# Altium schematic sheet SYSMON.SchDoc
size A3
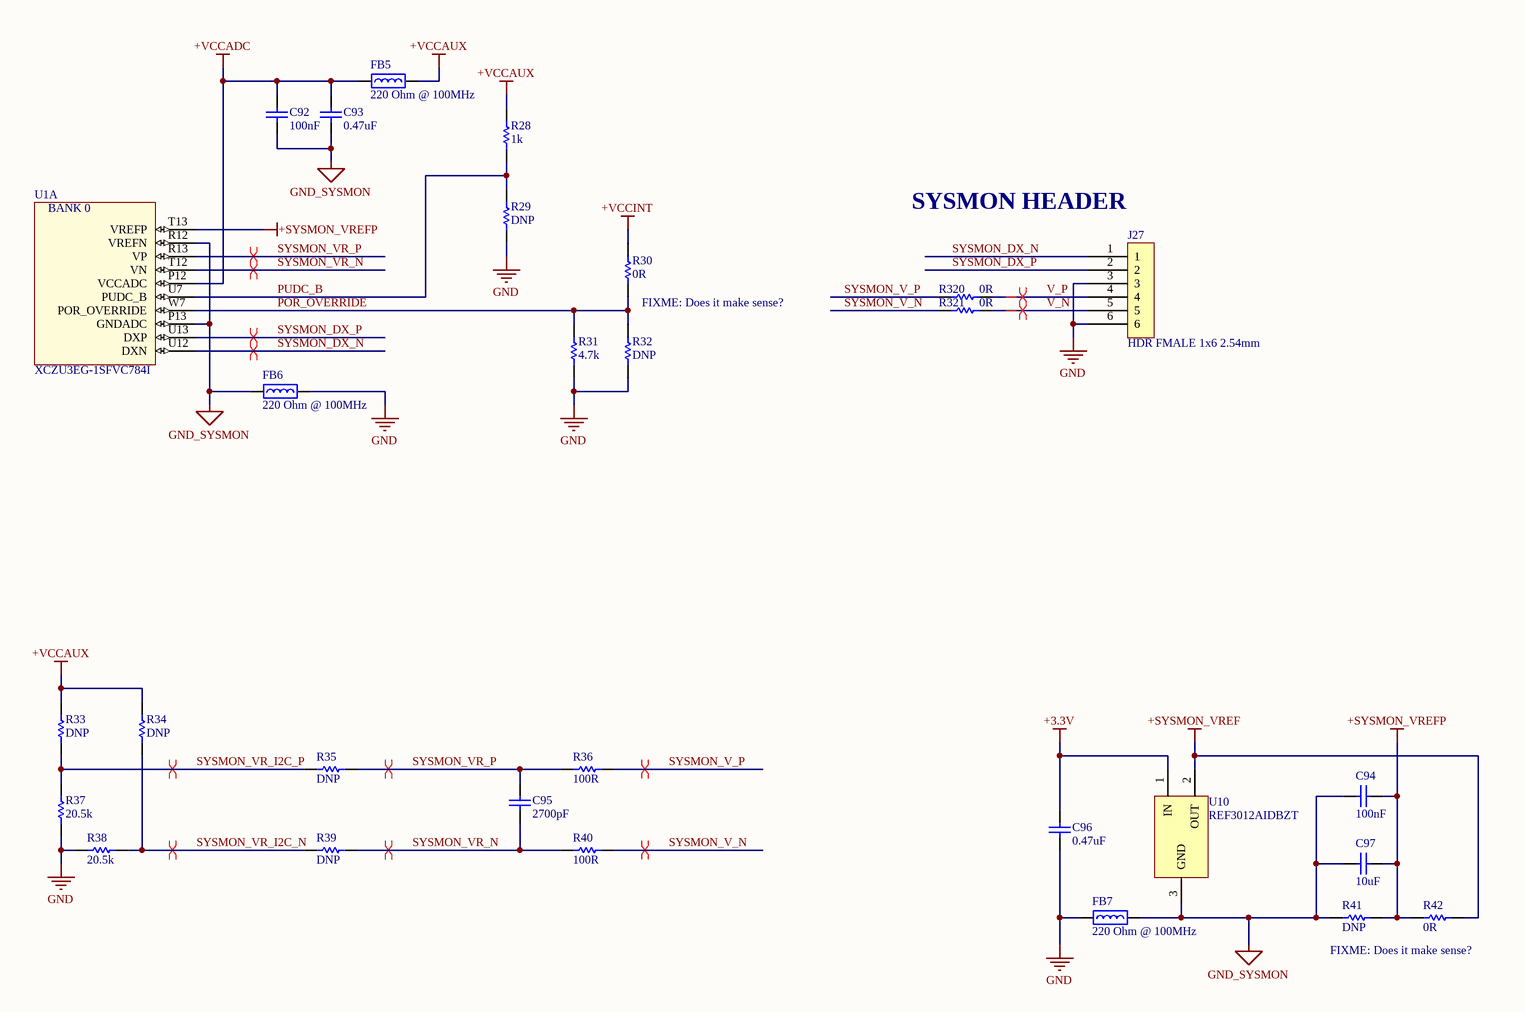
[diagram p0: SYSMON.SchDoc]

## Parts
C92  100nF  [CAPC1005L_0402]
C93  0.47uF  [CAPC1005L_0402]
C94  100nF  [CAPC1005L_0402]
C95  2700pF  [CAPC1005L_0402]
C96  0.47uF  [CAPC1005L_0402]
C97  10uF  [CAPC1005L_0402]
FB5  Impedance @ Frequency: 220 Ohm @ 100MHz  [INDC1608N_0603]  (hidden comment: BEAD0603_220_2A5_40M)
FB6  Impedance @ Frequency: 220 Ohm @ 100MHz  [INDC1608N_0603]  (hidden comment: BEAD0603_220_2A5_40M)
FB7  Impedance @ Frequency: 220 Ohm @ 100MHz  [INDC1608N_0603]  (hidden comment: BEAD0603_220_2A5_40M)
J27  HDR FMALE 1x6 2.54mm  [Hdr_Female_1x6_2.54mm]
R28  value 1k  [RESC1005L_0402]  (hidden comment: RES0402_1K_0W1_1T)
R29  value DNP  [RESC1005L_0402]  (hidden comment: RES0402)
R30  value 0R  [RESC1005L_0402]  (hidden comment: RES0402_0R_0W1)
R31  value 4.7k  [RESC1005L_0402]  (hidden comment: RES0402_4K7_0W1_1T)
R32  value DNP  [RESC1005L_0402]  (hidden comment: RES0402)
R33  value DNP  [RESC1005L_0402]  (hidden comment: RES0402)
R34  value DNP  [RESC1005L_0402]  (hidden comment: RES0402)
R35  value DNP  [RESC1005L_0402]  (hidden comment: RES0402)
R36  value 100R  [RESC1005L_0402]  (hidden comment: RES0402_100R_0W1_1T)
R37  value 20.5k  [RESC1005L_0402]  (hidden comment: RES0402_20K5_0W1_1T)
R38  value 20.5k  [RESC1005L_0402]  (hidden comment: RES0402_20K5_0W1_1T)
R39  value DNP  [RESC1005L_0402]  (hidden comment: RES0402)
R40  value 100R  [RESC1005L_0402]  (hidden comment: RES0402_100R_0W1_1T)
R41  value DNP  [RESC1005L_0402]  (hidden comment: RES0402)
R42  value 0R  [RESC1005L_0402]  (hidden comment: RES0402_0R_0W1)
R320  value 0R  [RESC1005L_0402]  (hidden comment: RES0402_0R_0W1)
R321  value 0R  [RESC1005L_0402]  (hidden comment: RES0402_0R_0W1)
U1  XCZU3EG-1SFVC784I  [BGA784x28]  (part A of 22)
U10  REF3012AIDBZT  [TI-DBZ3_N]

## Nets
+3.3V: C96.1 U10.1(IN)
+SYSMON_VREF: R42.1 U10.2(OUT)
+SYSMON_VREFP: C94.1 C97.2 R41.1 R42.2 U1.T13(VREFP)
+VCCADC: C92.1 C93.1 FB5.1 U1.P12(VCCADC)
+VCCAUX: FB5.2 R28.1 R33.1 R34.1
+VCCINT: R30.1
GND: C96.2 FB6.2 FB7.1 J27.3 J27.6 R29.2 R31.2 R32.2 R37.2 R38.2
GND_SYSMON: C92.2 C93.2 C94.2 C97.1 FB6.1 FB7.2 R41.2 U1.P13(GNDADC) U1.R12(VREFN) U10.3(GND)
POR_OVERRIDE: R30.2 R31.1 R32.1 U1.W7(POR_OVERRIDE)
PUDC_B: R28.2 R29.1 U1.U7(PUDC_B)
SYSMON_DX_N: J27.1 U1.U12(DXN)
SYSMON_DX_P: J27.2 U1.U13(DXP)
SYSMON_V_N: R40.2 R321.1
SYSMON_V_P: R36.2 R320.1
SYSMON_VR_I2C_N: R34.2 R38.1 R39.2
SYSMON_VR_I2C_P: R33.2 R35.2 R37.1
SYSMON_VR_N: C95.2 R39.1 R40.1 U1.T12(VN)
SYSMON_VR_P: C95.1 R35.1 R36.1 U1.R13(VP)
V_N: J27.5 R321.2
V_P: J27.4 R320.2

## Layout directives
differential pair: SYSMON_DX_N, SYSMON_DX_P, SYSMON_V_N, SYSMON_V_P, SYSMON_VR_I2C_N, SYSMON_VR_I2C_P, SYSMON_VR_N, SYSMON_VR_P, V_N, V_P

## Notes on the sheet
- SYSMON HEADER
- FIXME: Does it make sense?
- (in symbol XCZU3EG-1SFVC784I, part A) BANK 0

## Library data of the parts
C92 C94 = CAPCER0402X7R100N25V_10T: CAP CER 0.1UF 25V X7R 0402; Manufacturer 1: Murata Electronics North America; Manufacturer Part Number 1: GRM155R71E104KE14D; Tolerance: 10%; Package: 0402; ComponentLink1Description: Datasheet; Value: 100nF; Voltage: 25V; Temperature Coefficient: X7R; Supplier 1: Digi-Key; Supplier Part Number 1: 490-10698-1-ND; Operating Temperature: -55°C ~ 125°C
C93 C96 = CAPCER0402X5R0U4710V_10T: CAP CER 0.47UF 10V X5R 0402; Manufacturer 1: Murata Electronics North America; Manufacturer Part Number 1: GRM155R61A474KE15D; Tolerance: 10%; Package: 0402; ComponentLink1Description: Datasheet; Value: 0.47uF; Voltage: 10V; Temperature Coefficient: X5R; Supplier 1: Digi-Key; Supplier Part Number 1: 490-3264-1-ND; Operating Temperature: -55°C ~ 85°C
C95 = CAPCER0402X7R2700P50V_10T: CAP CER 2700PF 50V X7R 0402; Manufacturer 1: Murata Electronics North America; Manufacturer Part Number 1: GRM155R71H272KA01D; Tolerance: 10%; Package: 0402; ComponentLink1Description: Datasheet; Value: 2700pF; Voltage: 50V; Temperature Coefficient: X7R; Supplier 1: Digi-Key; Supplier Part Number 1: 490-1306-1-ND; Operating Temperature: -55°C ~ 125°C
C97 = CAPCER0402X5R10U10V_20T: CAP CER 10UF 10V X5R 0402; Manufacturer 1: Samsung Electro-Mechanics America, Inc.; Manufacturer Part Number 1: CL05A106MP5NUNC; Tolerance: 20%; Package: 0402; ComponentLink1Description: Datasheet; Value: 10uF; Voltage: 10V; Temperature Coefficient: X5R; Supplier 1: Digi-Key; Supplier Part Number 1: 1276-1450-1-ND; Operating Temperature: -55°C ~ 85°C
FB5-FB7 = BEAD0603_220_2A5_40M: FERRITE BEAD 220 OHM 0603 1LN; Manufacturer 1: Murata Electronics North America; Manufacturer Part Number 1: BLM18SG221TN1D; Current Rating (Max): 2.5A; DC Resistance (DCR) (Max): 40 mohm; Package: 0603; ComponentLink1Description: Datasheet; ComponentLink1URL: C:\Users\Public\Documents\Altium\AD16\Library\PDF\ENFA0003.pdf; Supplier 1: Digi-Key; Supplier Part Number 1: 490-5225-1-ND; Operating Temperature: -55°C ~ 125°C
J27 = M20-7820646: 06-WAY SIL VERT SOCKET L/FREE; Manufacturer 1: Harwin Inc; Connector Type: Receptacle; Number of Positions: 6; Number of Positions Loaded: All; Pitch: 0.100" (2.54mm); .Checked PCB: MM; Supplier 1: Digi-Key; Manufacturer Part Number 1: M20-7820646; RoHS: RoHS Compliant; Category: Connectors, Interconnects; Stock 1: 87; Pricing 1: 1=0.96, 38=0.79211, 76=0.75895, 114=0.72596, 266=0.66, 532=0.594, 1026=0.528, 2508=0.4785 (USD); Packaging: Tube; Contact Type: Female Socket; Number of Rows: 1; Row Spacing: -; Mounting Type: Through Hole; Termination: Solder; Fastening Type: -; Features: -; Contact Finish: Tin; Contact Finish Thickness: -; Color: Black; ComponentLink1URL: http://harwin.com/includes/pdfs/M20-782.pdf; ComponentLink1Description: http://harwin.com/includes/pdfs/M20-782.pdf; Supplier Part Number 1: 952-1809-ND; .Checked SCH: MM; .Creator: MM
R28 = RES0402_1K_0W1_1T: RES SMD 1K OHM 1% 1/10W 0402; Manufacturer 1: Panasonic Electronic Components; Manufacturer Part Number 1: ERJ-2RKF1001X; Package: 0402; ComponentLink1Description: Datasheet; Power: 1/10W; Tolerance: 1%; Supplier 1: Digi-Key; Supplier Part Number 1: P1.00KLCT-ND
R29 R32-R35 R39 R41 = RES0402: RES SMD 0402 Footprint; Package: 0402; ComponentLink1Description: Datasheet; Tolerance: -
R30 R42 R320 R321 = RES0402_0R_0W1: RES SMD 0 OHM JUMPER 1/10W 0402; Manufacturer 1: Panasonic Electronic Components; Manufacturer Part Number 1: ERJ-2GE0R00X; Package: 0402; ComponentLink1Description: Datasheet; Power: 1/10W; Tolerance: -; Supplier 1: Digi-Key; Supplier Part Number 1: P0.0JCT-ND
R31 = RES0402_4K7_0W1_1T: RES SMD 4.7K OHM 1% 1/10W 0402; Manufacturer 1: Panasonic Electronic Components; Manufacturer Part Number 1: ERJ-2RKF4701X; Package: 0402; ComponentLink1Description: Datasheet; Power: 1/10W; Tolerance: 1%; Supplier 1: Digi-Key; Supplier Part Number 1: P4.70KLCT-ND
R36 R40 = RES0402_100R_0W1_1T: RES SMD 100 OHM 1% 1/10W 0402; Manufacturer 1: Panasonic Electronic Components; Manufacturer Part Number 1: ERJ-2RKF1000X; Package: 0402; ComponentLink1Description: Datasheet; Power: 1/10W; Tolerance: 1%; Supplier 1: Digi-Key; Supplier Part Number 1: P100LCT-ND
R37 R38 = RES0402_20K5_0W1_1T: RES SMD 20.5K OHM 1% 1/10W 0402; Manufacturer 1: Panasonic Electronic Components; Manufacturer Part Number 1: ERJ-2RKF2052X; Package: 0402; ComponentLink1Description: Datasheet; Power: 1/10W; Tolerance: 1%; Supplier 1: Digi-Key; Supplier Part Number 1: P20.5KLCT-ND
U1 = XCZU3EG-1SFVC784I: IC FPGA 252 I/O 784FCBGA - XILINX ZYNQ ULTRASCALE+; Manufacturer 1: Xilinx Inc.; Package: SFVC784; ComponentLink1Description: Datasheet; Supplier 1: Digi-Key; Supplier Part Number 1: XCZU3EG-1SFVC784I-ND; Manufacturer Part Number 1: XCZU3EG-1SFVC784I
U10 = REF3012AIDBZT: IC VREF SERIES 1.25V SOT23-3; Manufacturer 1: Texas Instruments; Voltage - Input: 1.8 V ~ 5.5 V; ComponentLink1Description: Datasheet; ComponentLink1URL: C:\Users\Public\Documents\Altium\AD16\Library\PDF\ref3012.pdf; Supplier 1: Digi-Key; Supplier Part Number 1: REF3012AIDBZTCT-ND; Manufacturer Part Number 1: REF3012AIDBZT; Operating Temperature: -40°C ~ 125°C (TA); Voltage - Output (Min/Fixed): 1.25V